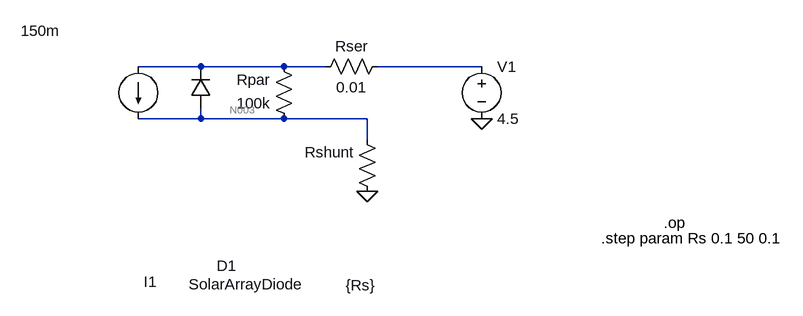
[diagram p0: schematic resistor_simple.asc]
resistor_simple.asc, the LTspice schematic file:
Version 4
SHEET 1 2604 2436
WIRE -384 576 -480 576
WIRE -256 576 -384 576
WIRE -192 576 -256 576
WIRE 48 576 -112 576
WIRE -384 656 -384 640
WIRE -384 656 -480 656
WIRE -256 656 -384 656
WIRE -128 656 -256 656
WIRE -128 688 -128 656
FLAG 48 656 0
FLAG -128 768 0
SYMBOL current -480 576 R0
WINDOW 0 8 331 Left 2
WINDOW 3 -181 -55 Left 2
WINDOW 123 0 0 Left 2
WINDOW 39 0 0 Left 2
SYMATTR InstName I1
SYMATTR Value 150m
SYMBOL diode -368 640 R180
WINDOW 3 -142 -271 Left 2
WINDOW 0 -39 -242 Left 2
SYMATTR Value SolarArrayDiode
SYMATTR InstName D1
SYMBOL res -240 672 R180
WINDOW 0 36 76 Left 2
WINDOW 3 36 40 Left 2
SYMATTR InstName Rpar
SYMATTR Value 100k
SYMBOL res -96 560 R90
WINDOW 0 0 56 VBottom 2
WINDOW 3 32 56 VTop 2
SYMATTR InstName Rser
SYMATTR Value 0.01
SYMBOL voltage 48 560 R0
WINDOW 123 0 0 Left 2
WINDOW 39 0 0 Left 2
SYMATTR InstName V1
SYMATTR Value 4.5
SYMBOL res -112 784 R180
WINDOW 0 36 76 Left 2
WINDOW 3 3 -128 Left 2
SYMATTR InstName Rshunt
SYMATTR Value {Rs}
TEXT 328 816 Left 2 !.op
TEXT 232 840 Left 2 !.step param Rs 0.1 50 0.1

The netlist it stands for:
* resistor_simple.asc
I1 N001 N003 150m
D1 N003 N001 SolarArrayDiode
Rpar N003 N001 100k
Rser N002 N001 0.01
V1 N002 0 4.5
Rshunt 0 N003 {Rs}
.model D D
.lib standard.dio
.op
.step param Rs 0.1 50 0.1
.backanno
.end

* Results of the author's LTspice run, read from the files saved beside the schematic
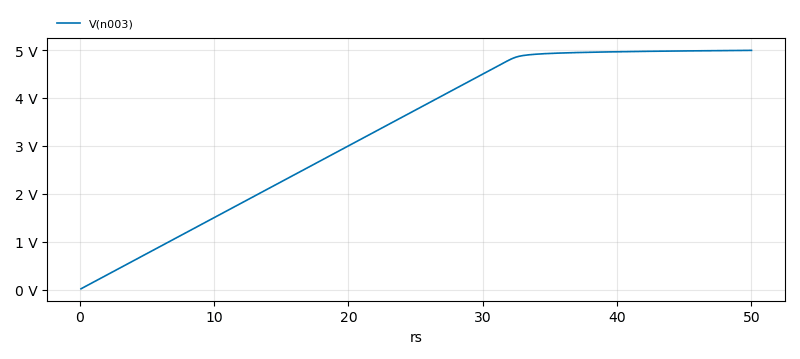
[diagram p1: Operating Point of resistor_simple.asc, plotted from the saved traces]
* Operating Point, 1 run:
*   V(n003): 15 mV at rs=100 m, 4.995 V at rs=50 , min 15 mV, max 4.995 V
* From the log:
*   Semiconductor Device Operating Points:
*                           --- Diodes ---
*   Name:        d1
*   Model: solararraydiode
*   Id:       -6.04e-10
*   Vd:       -4.48e+00
*   Req:       1.00e+12
*   CAP:       6.41e-11